# EAGLE board SolarZ (EAGLE 9.3.1), part 1 of 2
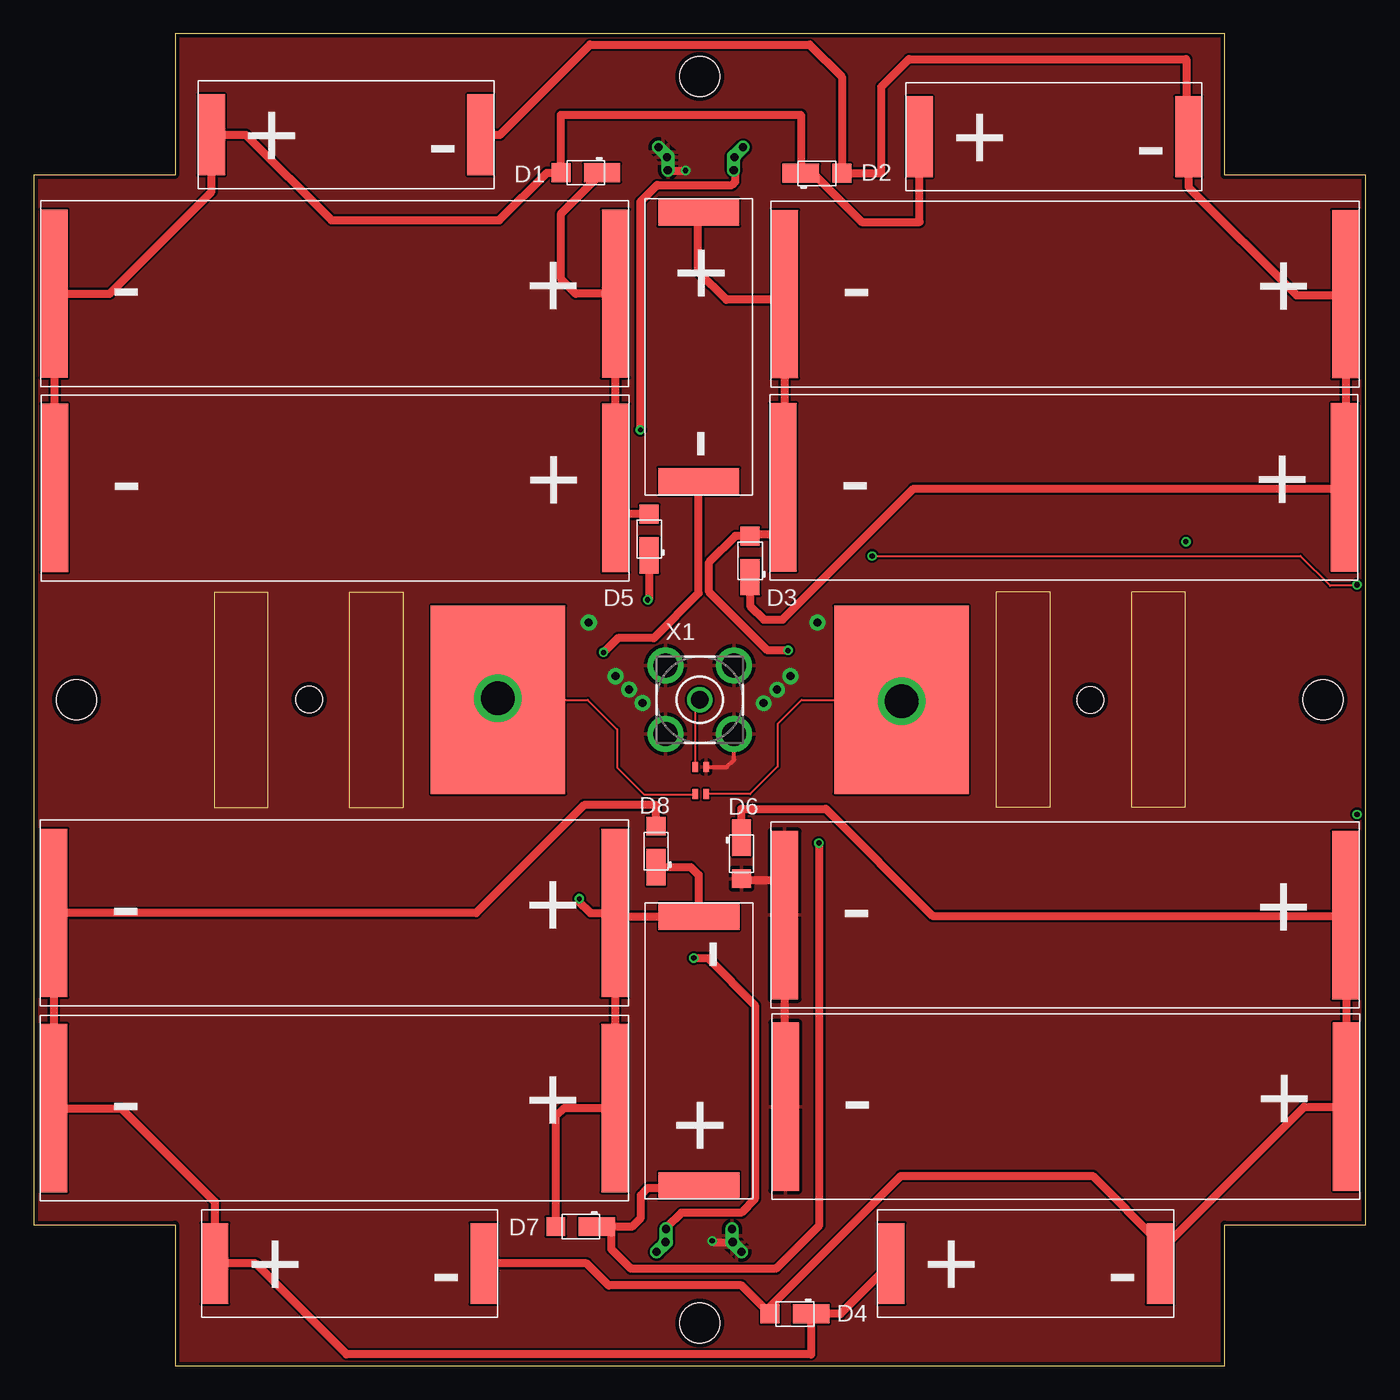
[diagram p1: board, top side]
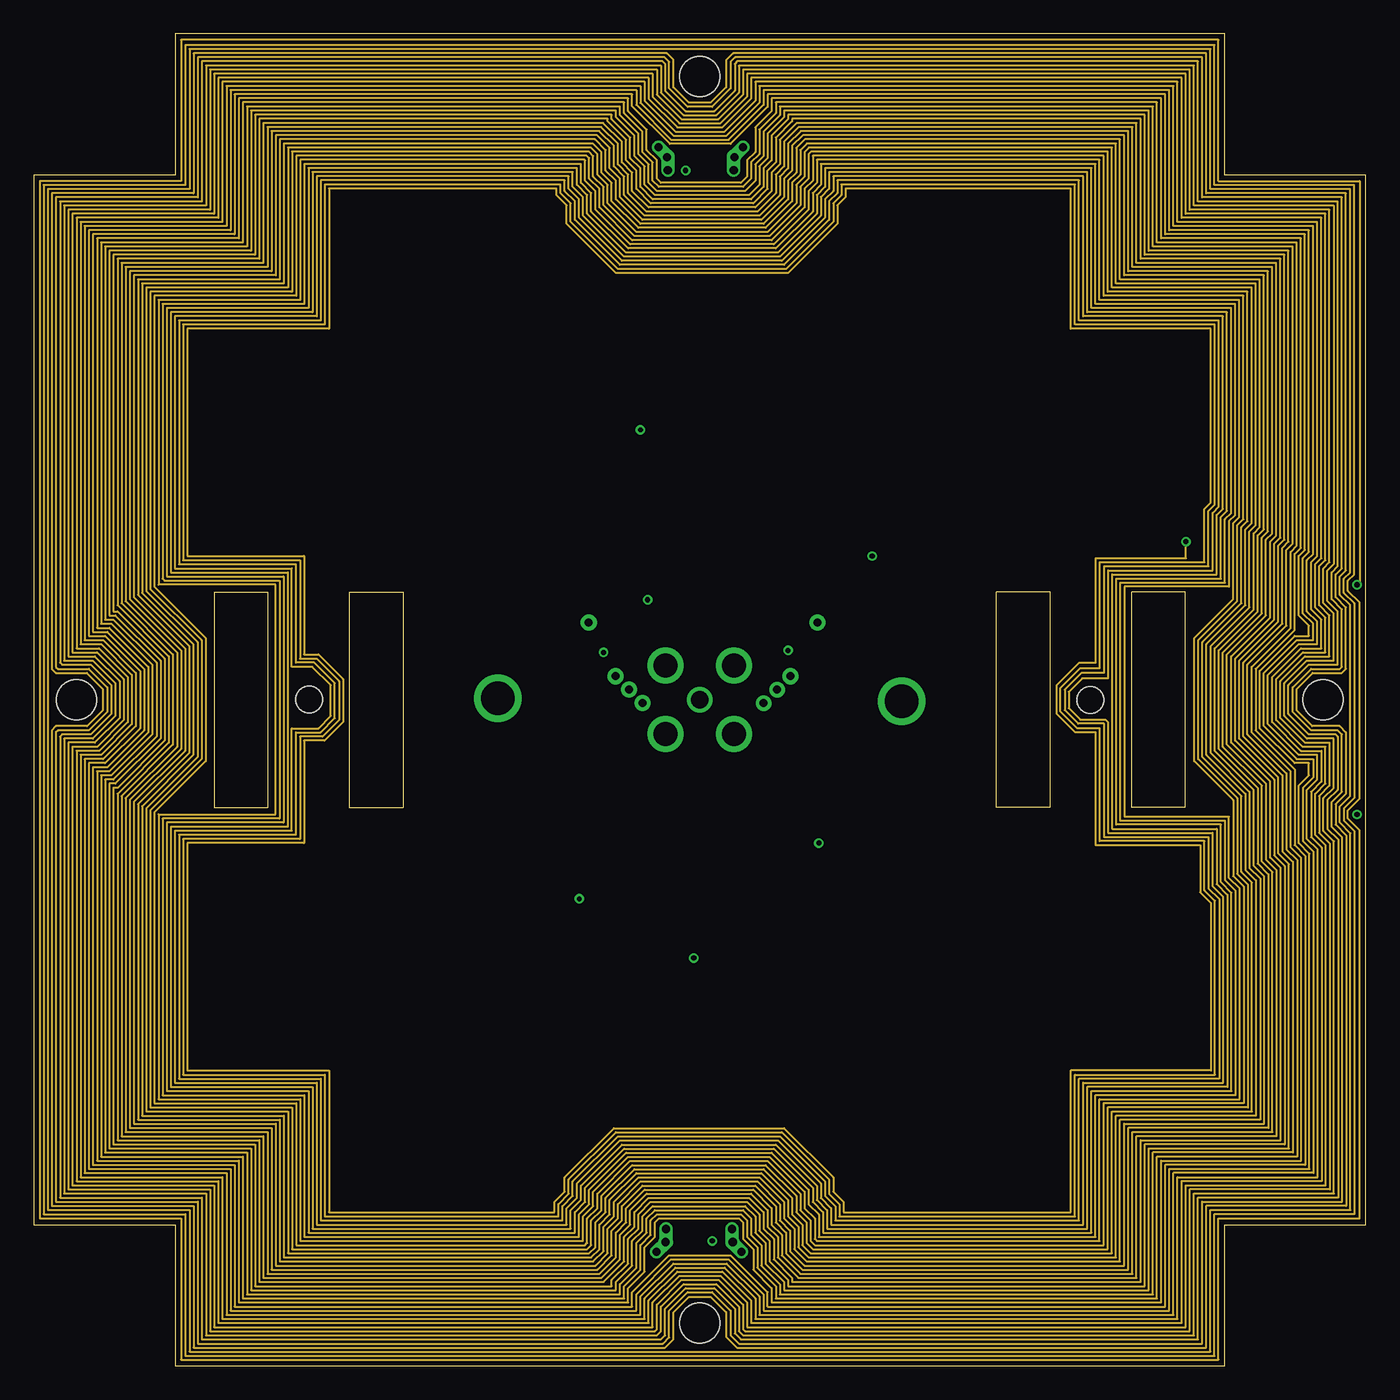
[diagram p2: board, inner layer Route2]
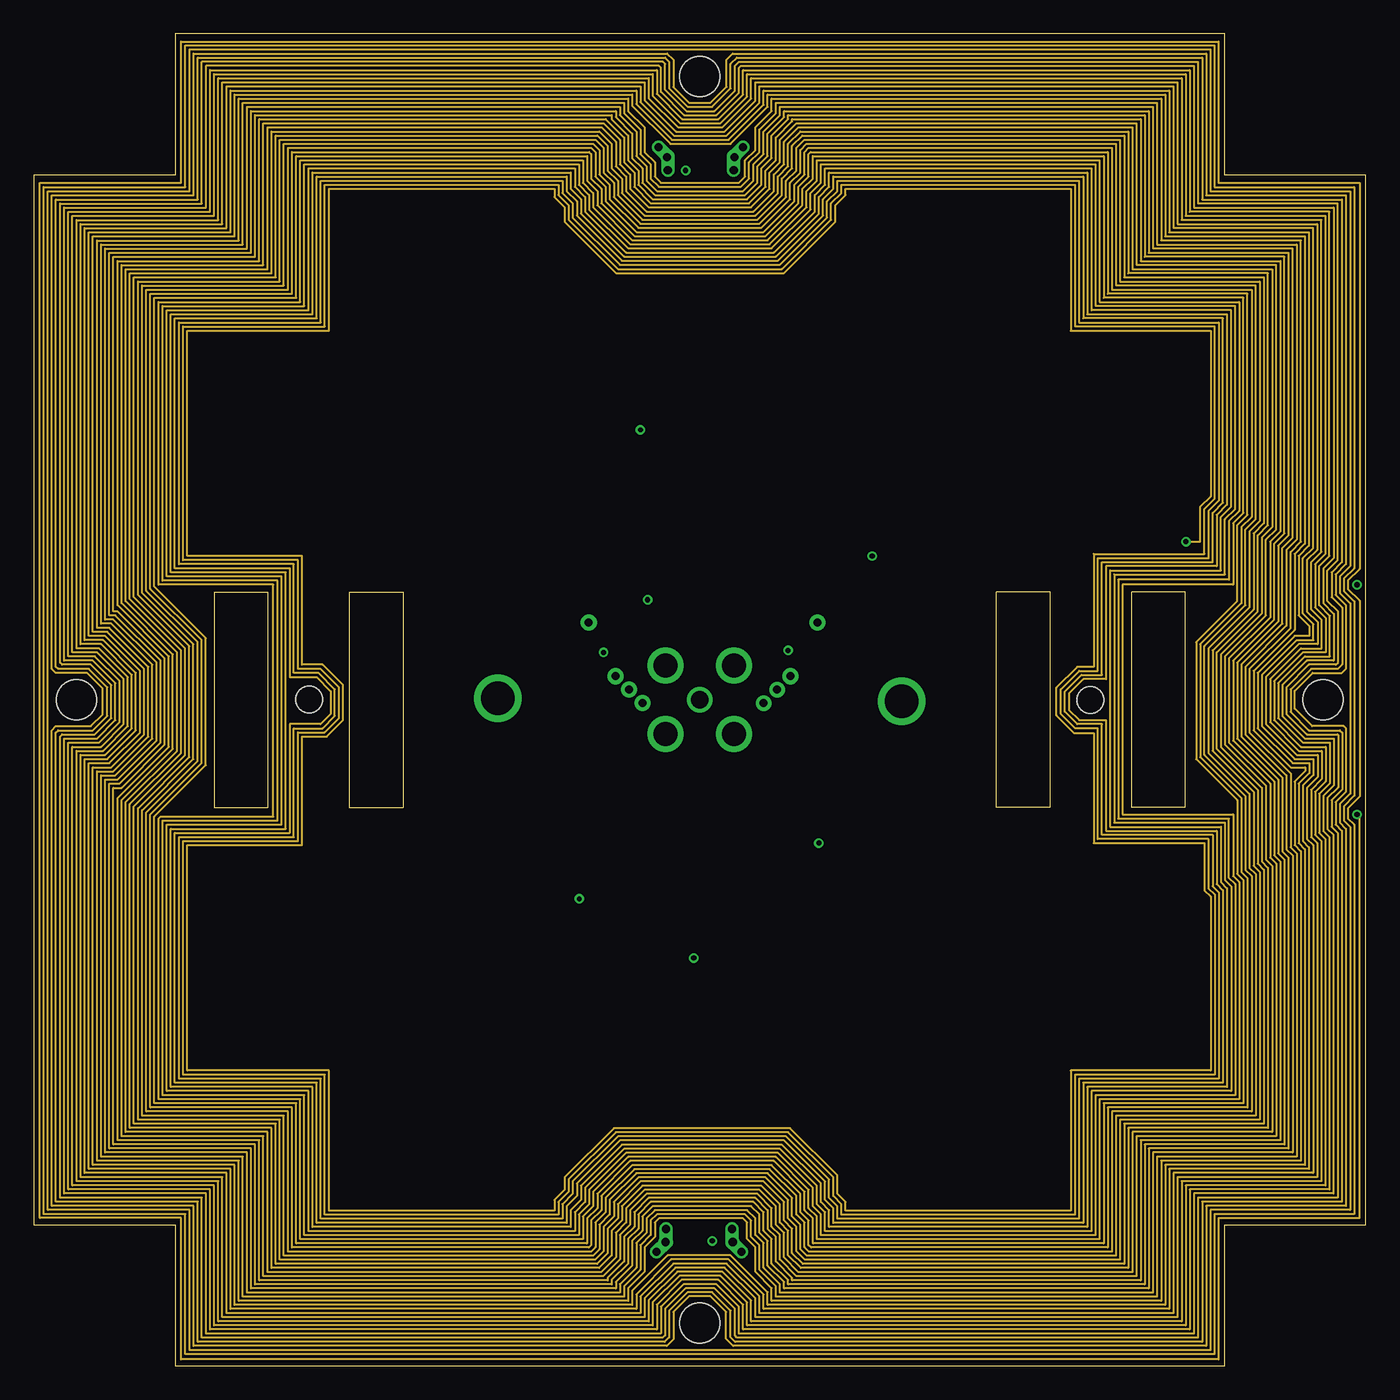
[diagram p3: board, inner layer Route15]
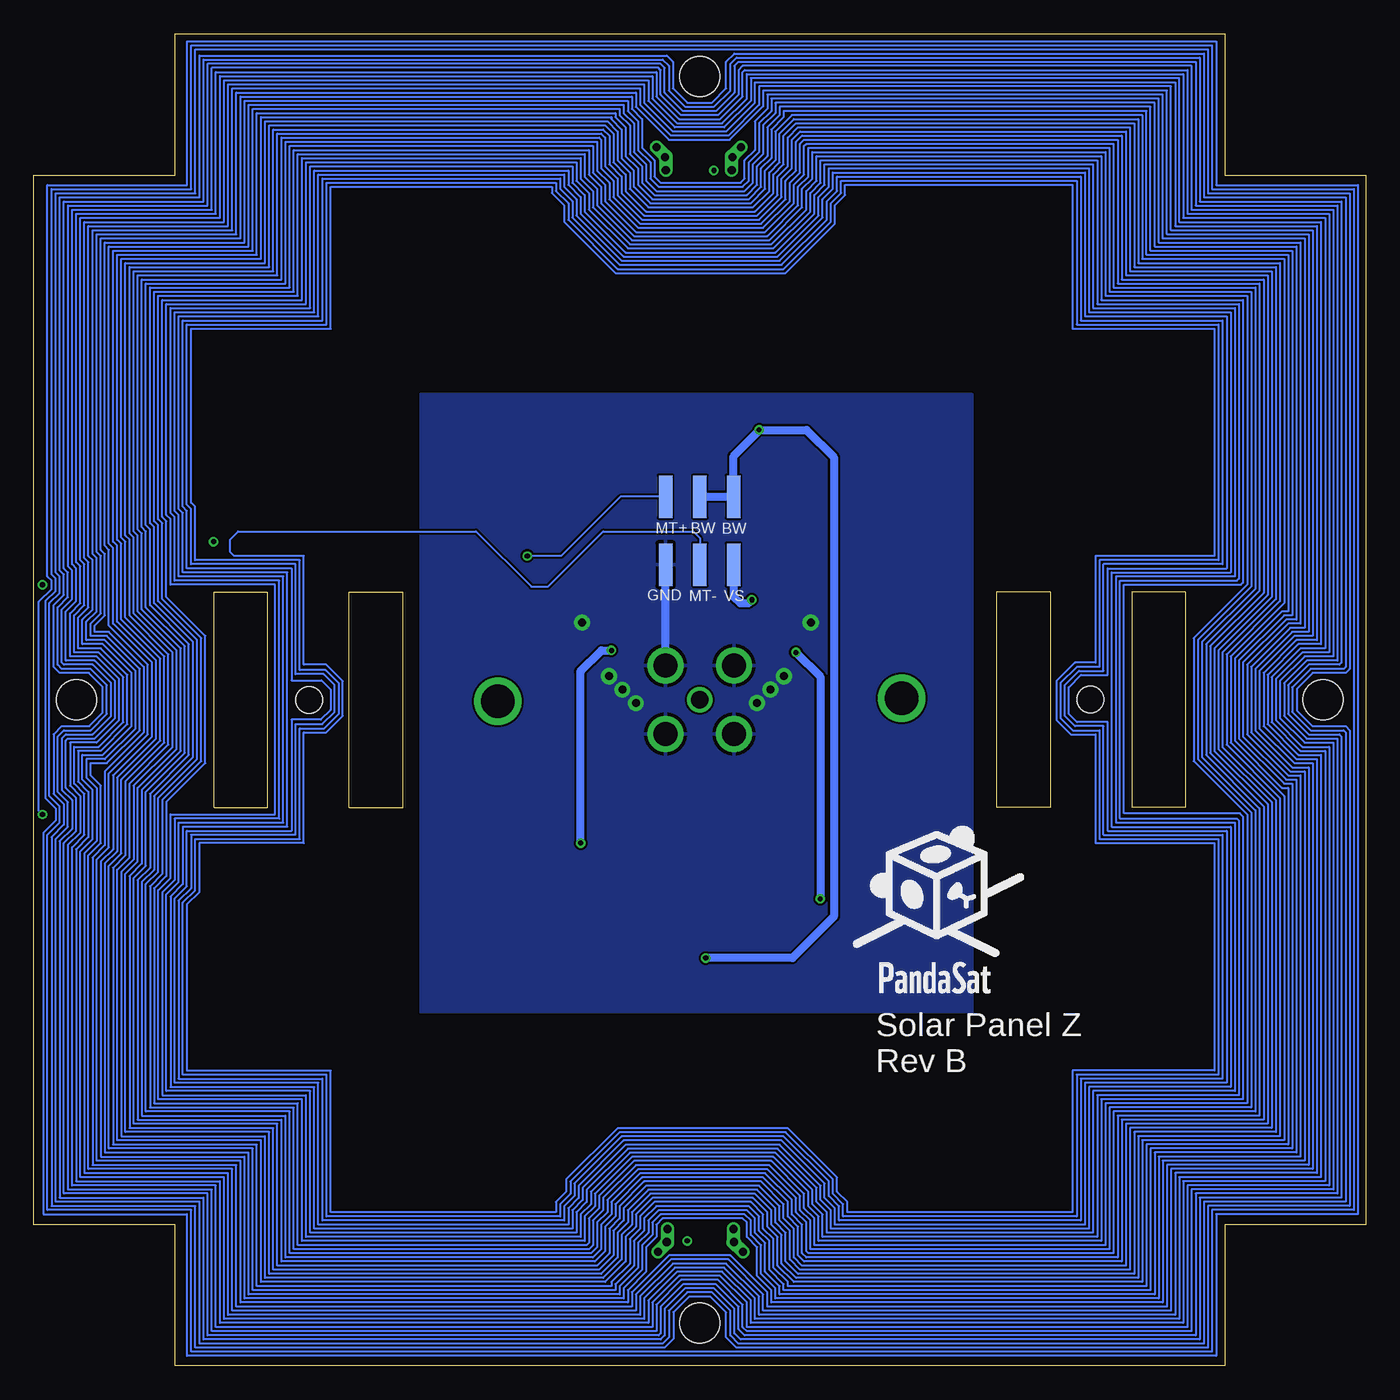
[diagram p4: board, bottom side, seen from below]

Size 99 x 99 mm. Coordinates in mm from the lower left corner, seen from the top.
Outline: 0,10.5 10.5,10.5 10.5,0 88.5,0 88.5,10.5 99,10.5 99,88.5 88.5,88.5 88.5,99 10.5,99 10.5,88.5 0,88.5 0,10.5
Copper layers (1*2*15*16): Top 0.035559375mm / dielectric 0.17018125mm / Route2 0.01778125mm / dielectric 47mil / Route15 0.01778125mm / dielectric 0.17018125mm / Bottom 0.035559375mm
Design rules "oshpark-4layer *": minimum track width 6mil, minimum drill 10mil, track to track 6mil, track to pad 6mil, pad to pad 6mil, via to via 10mil, smd to smd 6mil, copper to edge 12mil, drill to drill 6mil, minimum pad ring 4mil, minimum via ring 4mil, stop-mask expansion 2.5mil, vias tented up to drill 0mil, thermal gap 10mil
Net classes: 0 default: width 0.152 mm, drill 0.3 mm, clearance 0.127 mm
Holes 3 mm at 49.5,3.17 3.17,49.5 49.5,95.83 95.83,49.5
tKeepout: area 46.8,0.4 to 52.2,5.9; area 0.4,46.8 to 5.9,52.2; area 46.8,93.1 to 52.2,98.6; area 93.1,46.8 to 98.6,52.2
bKeepout: area 46.8,0.4 to 52.2,5.9; area 0.6,46.8 to 6.1,52.2; area 46.8,93.1 to 52.2,98.6; area 93.1,46.8 to 98.6,52.2

## Footprints (pad centres in the part's own frame; a part is rotated, then mirrored left to right if it is on the bottom)
KXOB22-04X3F = smd 2 x 6: P$1 1,4; P$2 21,4
SLMD121H04L = smd 2 x 12.5: P$1 1,6.9; P$2 42.7,6.9
SB_DIODE = smd 2.7 x 1.4: NEG -1.2,0 | smd 1.4 x 1.4: POS 1.85,0
BURN_WIRE = drill 0.6 pad 1.016 offset: 1 -5.65,-2.032; 2 0.65,-2.032; 100 -4.95,-0.332; 200 -0.05,-0.332 | drill 0.6 pad 1.016: 10 -5,-1.3; 20 0,-1.3
BALUN = smd 0.4 x 0.75: 1 -0.4,1; 2 0.4,1; 3 -0.4,-1; 4 0.4,-1
TAPE = drill 2.5 pad 3: RF 0,0.1 | smd 10 x 14: RF_2 0,0 | hole 2: -14.03,0.02
M20-8760342 = smd 1 x 3.15: P$1 0.5,1.575; P$2 0.5,6.625; P$3 3.04,1.575; P$4 3.04,6.625; P$5 5.54,1.575; P$6 5.54,6.625
BU-SMA-V = drill 1.27: 1 0,0 | drill 1.778: 2 -2.55,2.55; 3 2.55,2.55; 4 2.55,-2.55; 5 -2.55,-2.55

## Placement (x,y rotation side)
1  KXOB22-04X3F  [KXOB22-04X3F]  34.22,95.49 180 top
2  SLMD121H04L  [SLMD121H04L]  0.56,58.34 0 top
3  SLMD121H04L  [SLMD121H04L]  0.52,72.78 0 top
4  SLMD121H04L  [SLMD121H04L]  54.8,72.74 0 top
5  SLMD121H04L  [SLMD121H04L]  54.7,58.38 0 top
6  KXOB22-04X3F  [KXOB22-04X3F]  84.72,11.61 180 top
7  KXOB22-04X3F  [KXOB22-04X3F]  34.47,11.61 180 top
8  SLMD121H04L  [SLMD121H04L]  54.8,26.6 0 top
9  SLMD121H04L  [SLMD121H04L]  54.86,12.36 0 top
10  KXOB22-04X3F  [KXOB22-04X3F]  45.45,34.4 270 top
11  KXOB22-04X3F  [KXOB22-04X3F]  53.42,64.72 90 top
12  SLMD121H04L  [SLMD121H04L]  0.5,26.75 0 top
13  KXOB22-04X3F  [KXOB22-04X3F]  86.83,95.33 180 top
14  SLMD121H04L  [SLMD121H04L]  0.5,12.25 0 top
D1  SB_DIODE  [SB_DIODE]  41.04,88.67 180 top
D2  SB_DIODE  [SB_DIODE]  58.22,88.62 0 top
D3  SB_DIODE  [SB_DIODE]  53.24,59.82 90 top
D4  SB_DIODE  [SB_DIODE]  56.57,3.86 180 top
D5  SB_DIODE  [SB_DIODE]  45.74,61.44 90 top
D6  SB_DIODE  [SB_DIODE]  52.6,38.05 270 top
D7  SB_DIODE  [SB_DIODE]  40.65,10.35 180 top
D8  SB_DIODE  [SB_DIODE]  46.25,38.25 90 top
F1  [BURN_WIRE]  51.95,10.5 0 top
F2  [BURN_WIRE]  47.07,88.53 180 top
U$1  BALUN  [BALUN]  49.58,43.49 180 top
U$2  [TAPE]  64.5,49.5 180 top
U$3  [TAPE]  34.5,49.5 0 top
U$4  M20-8760342  [M20-8760342]  52.53,57.97 0 bottom
X1  BU-SMA-V  [BU-SMA-V]  49.5,49.5 0 top

## Tracks (layer width: path | path; a pad name or v marks a point on that pad's centre or on a via)
GND  (via drill 0.38 pad 0.7, 0.6 pad 1.15, 0.6 pad 1.2)
  Top 0.305: U$1.3 51.5,44.49 52.05,45.04 X1.4
  Top 0.61: D6.POS 52.7,36.1 55.71,36.1 55.8,36.01 8.P$1 55.8,19.32 9.P$1 | v50.43,9.28 50.51,9.2 F1.20 | F1.200 51.95,10.12 F1.20 | F1.2 51.95,9.12 F1.20 | F2.20 47.07,89.91 F2.2 47.12,89.86 F2.200 47.15,88.83 v48.45,88.83
  Bottom 0.61: X1.3 52.05,59.52 U$4.P$1
  other vias: 58.25,55.25 56.25,51.25 55.25,50.25 54.25,49.25 45.25,49.25 44.25,50.25 43.25,51.25 41.25,55.25
  pour Top: 8.36,99.2 8.36,90.66 -0.17,90.66 -0.17,8.36 8.36,8.36 8.36,-0.17 90.66,-0.17 90.66,8.36 99.2,8.36 99.2,90.66 90.66,90.66 90.66,99.2
  pour Bottom: 29.25,72.25 29.25,26.25 70.25,26.25 70.25,72.25
N8
  Top 0.61: D8.POS 46.25,41.66 40.9,41.66 32.89,33.65 12.P$1 14.P$1 6.52,19.15 13.47,12.2 7.P$2 16.49,7.61 23.25,0.85 57.77,0.85 D4.NEG 59.97,3.86 6.P$2
N$1
  Top 0.152: U$1.2 49.16,42.48 45.35,42.48 43.37,44.46 43.37,47.3 41.17,49.5 U$3.RF_2 U$3.RF
N$2
  Top 0.152: U$1.4 49.18,49.18 X1.1
N$3
  Top 0.152: U$1.1 53.24,42.49 55.28,44.53 55.28,47.71 57.07,49.5 U$2.RF_2 U$2.RF
N$6
  Top 0.61: 2.P$1 1.56,79.64 3.P$1 5.64,79.68 13.21,87.26 1.P$2 15.77,91.49 22.13,85.12 34.6,85.12 38.14,88.67 D1.POS 39.19,92.97 57.02,92.97 D2.NEG 57.93,88.62 61.55,85 65.83,85 13.P$2
N$7
  Top 0.61: D5.POS 43.41,63.29 43.26,63.44 2.P$2 43.26,79.64 3.P$2 40.28,79.68 39.2,80.75 39.2,85.62 D1.NEG
N$8  (via drill 0.38 pad 0.7)
  Top 0.152: v62.31,60.18 94.14,60.18 96.35,57.97 98.27,57.97 v98.34,58.05
  Route2 0.152: v85.63,61.25 85.63,60.03 78.93,60.03 78.93,52.26 77.71,52.26 76.03,50.58 76.03,48.45 77.4,47.07 78.93,47.07 78.93,38.69 86.7,38.69 86.7,35.19 87.49,34.4 87.49,21.95 77.08,21.95 77.08,11.41 60.18,11.41 60.18,12.18 59.42,12.94 59.42,14 55.76,17.66 43.11,17.66 39.45,14 39.45,12.94 38.69,12.18 38.69,11.41 21.95,11.41 21.95,21.95 11.41,21.95 11.41,38.84 20.1,38.84 20.1,46.47 21.62,46.47 23,47.84 23,51.04 21.17,52.87 20.1,52.87 20.1,60.18 11.41,60.18 11.41,77.08 21.95,77.08 21.95,87.49 38.84,87.49 38.84,87 39.61,86.24 39.61,84.87 43.26,81.21 56.07,81.21 59.72,84.87 59.72,86.24 60.33,86.85 60.33,87.49 77.08,87.49 77.08,77.08 87.46,77.08 87.46,64.14 87,63.69 87,59.72 79.23,59.72 79.23,51.85 77.77,51.85 76.31,50.39 76.31,48.62 77.55,47.38 79.23,47.38 79.23,39 87,39 87,35.34 87.79,34.55 87.79,21.64 77.38,21.64 77.38,11.11 59.88,11.11 59.88,12.02 59.11,12.78 59.11,13.85 55.61,17.36 43.26,17.36 39.76,13.85 39.76,12.78 39,12.02 39,11.11 21.64,11.11 21.64,21.64 11.11,21.64 11.11,39.15 19.8,39.15 19.8,46.77 21.47,46.77 22.69,47.99 22.69,50.88 21.01,52.56 19.8,52.56 19.8,59.88 11.11,59.88 11.11,77.38 21.64,77.38 21.64,87.79 39.15,87.79 39.15,87.16 39.91,86.39 39.91,85.02 43.42,81.52 55.91,81.52 59.42,85.02 59.42,86.39 60.03,87 60.03,87.79 77.38,87.79 77.38,77.38 87.77,77.38 87.77,63.99 87.31,63.53 87.31,59.42 79.54,59.42 79.54,51.49 77.86,51.49 76.62,50.25 76.62,48.72 77.62,47.72 79.54,47.72 79.54,39.3 87.31,39.3 87.31,35.49 88.09,34.7 88.09,21.34 77.69,21.34 77.69,10.8 59.57,10.8 59.57,11.87 58.81,12.63 58.81,13.7 55.46,17.05 43.42,17.05 40.06,13.7 40.06,12.63 39.3,11.87 39.3,10.8 21.34,10.8 21.34,21.34 10.8,21.34 10.8,39.45 19.49,39.45 19.49,47.07 21.32,47.07 22.39,48.14 22.39,50.73 20.86,52.26 19.49,52.26 19.49,59.57 10.8,59.57 10.8,77.69 21.34,77.69 21.34,88.09 39.45,88.09 39.45,87.31 40.22,86.55 40.22,85.17 43.57,81.82 55.76,81.82 59.11,85.17 59.11,86.55 59.72,87.16 59.72,88.09 77.69,88.09 77.69,77.69 88.07,77.69 88.07,63.84 87.61,63.38 87.61,59.11 79.84,59.11 79.84,51.09 77.93,51.09 76.92,50.08 76.92,48.88 77.77,48.02 79.65,48.02 79.84,47.84 79.84,39.61 87.61,39.61 87.61,35.64 88.4,34.86 88.4,21.03 77.99,21.03 77.99,10.5 59.27,10.5 59.27,11.72 58.5,12.48 58.5,13.55 55.3,16.75 43.57,16.75 40.37,13.55 40.37,12.48 39.61,11.72 39.61,10.5 21.03,10.5 21.03,21.03 10.5,21.03 10.5,39.76 19.19,39.76 19.19,47.38 21.17,47.38 22.08,48.29 22.08,50.58 20.71,51.95 19.19,51.95 19.19,59.27 10.5,59.27 10.5,77.99 21.03,77.99 21.03,88.4 39.76,88.4 39.76,87.46 40.52,86.7 40.52,85.33 43.72,82.13 55.61,82.13 58.81,85.33 58.81,86.7 59.42,87.31 59.42,88.4 77.99,88.4 77.99,77.99 88.38,77.99 88.38,63.69 87.92,63.23 87.92,58.81 80.14,58.81 80.14,39.91 87.92,39.91 87.92,35.8 88.7,35.01 88.7,20.73 78.3,20.73 78.3,10.19 58.96,10.19 58.96,11.57 58.2,12.33 58.2,13.39 55.15,16.44 43.72,16.44 40.67,13.39 40.67,12.33 39.91,11.57 39.91,10.19 20.73,10.19 20.73,20.73 10.19,20.73 10.19,40.06 18.88,40.06 18.88,58.96 10.19,58.96 10.19,78.3 20.73,78.3 20.73,88.7 40.06,88.7 40.06,87.61 40.83,86.85 40.83,85.48 43.87,82.43 55.46,82.43 58.5,85.48 58.5,86.85 59.11,87.46 59.11,88.7 78.3,88.7 78.3,78.3 88.68,78.3 88.68,63.53 88.22,63.08 88.22,58.5 80.45,58.5 80.45,40.22 88.22,40.22 88.22,35.95 89.01,35.16 89.01,20.42 78.6,20.42 78.6,9.89 58.66,9.89 58.66,11.41 57.9,12.18 57.9,13.24 55,16.14 43.87,16.14 40.98,13.24 40.98,12.18 40.22,11.41 40.22,9.89 20.42,9.89 20.42,20.42 9.89,20.42 9.89,40.37 18.58,40.37 18.58,58.66 9.89,58.66 9.89,78.6 20.42,78.6 20.42,89.01 40.37,89.01 40.37,87.77 41.13,87 41.13,85.63 44.03,82.74 55.3,82.74 58.2,85.63 58.2,87 58.81,87.61 58.81,89.01 78.6,89.01 78.6,78.6 88.98,78.6 88.98,63.38 88.53,62.92 88.53,58.2 80.75,58.2 80.75,40.52 88.53,40.52 88.53,36.1 89.31,35.31 89.31,20.12 78.91,20.12 78.91,9.58 58.35,9.58 58.35,11.26 57.59,12.02 57.59,13.09 54.85,15.83 44.03,15.83 41.28,13.09 41.28,12.02 40.52,11.26 40.52,9.58 20.12,9.58 20.12,20.12 9.58,20.12 9.58,40.67 18.27,40.67 18.27,58.35 9.74,58.35 9.58,58.5 9.58,78.91 20.12,78.91 20.12,89.31 40.67,89.31 40.67,87.92 41.44,87.16 41.44,85.78 44.18,83.04 55.15,83.04 57.9,85.78 57.9,87.16 58.5,87.77 58.5,89.31 78.91,89.31 78.91,78.91 89.29,78.91 89.29,63.23 88.83,62.77 88.83,57.9 81.06,57.9 81.06,40.83 88.83,40.83 88.83,36.25 89.62,35.47 89.62,19.81 79.21,19.81 79.21,9.28 58.2,9.28 58.05,9.43 58.05,10.96 57.28,11.72 57.28,12.94 54.69,15.53 44.18,15.53 41.59,12.94 41.59,11.87 40.83,11.11 40.83,9.28 19.81,9.28 19.81,19.81 9.28,19.81 9.28,40.98 17.97,40.98 17.97,58.05 9.28,58.05 9.28,79.21 19.81,79.21 19.81,89.62 40.95,89.62 40.98,89.59 40.98,88.07 41.74,87.31 41.74,85.94 44.33,83.35 55,83.35 57.59,85.94 57.59,87.31 58.2,87.92 58.2,89.62 79.21,89.62 79.21,79.21 89.59,79.21 89.59,63.08 89.14,62.62 89.14,56.98 86.24,54.09 86.24,44.94 89.14,42.05 89.14,36.41 89.92,35.62 89.92,19.51 79.52,19.51 79.52,8.97 58.05,8.97 57.74,9.28 57.74,10.8 56.98,11.57 56.98,12.78 54.54,15.22 44.33,15.22 41.89,12.78 41.89,11.72 41.13,10.96 41.13,9.13 40.98,8.97 19.51,8.97 19.51,19.51 8.97,19.51 8.97,41.13 12.78,44.94 12.78,54.09 8.97,57.9 8.97,79.52 19.51,79.52 19.51,89.92 41.1,89.92 41.28,89.75 41.28,88.22 42.05,87.46 42.05,86.09 44.48,83.65 54.85,83.65 57.28,86.09 57.28,87.46 57.9,88.07 57.9,89.9 57.92,89.92 79.52,89.92 79.52,79.52 89.9,79.52 89.9,62.92 89.44,62.47 89.44,56.83 86.55,53.93 86.55,45.09 89.44,42.2 89.44,36.56 90.23,35.77 90.23,19.2 79.82,19.2 79.82,8.67 57.9,8.67 57.44,9.13 57.44,10.65 56.68,11.41 56.68,12.63 54.39,14.92 44.48,14.92 42.2,12.63 42.2,11.57 41.44,10.8 41.44,8.97 41.13,8.67 19.2,8.67 19.2,19.2 8.67,19.2 8.67,41.28 12.48,45.09 12.48,53.93 8.67,57.74 8.67,79.82 19.2,79.82 19.2,90.23 41.26,90.23 41.59,89.9 41.59,88.38 42.35,87.61 42.35,86.24 44.64,83.95 54.69,83.95 56.98,86.24 56.98,87.61 57.59,88.22 57.59,90.05 57.77,90.23 79.82,90.23 79.82,79.82 90.2,79.82 90.2,62.77 89.75,62.31 89.75,56.68 86.85,53.78 86.85,45.25 89.75,42.35 89.75,36.71 90.53,35.92 90.53,18.9 80.13,18.9 80.13,8.37 57.74,8.37 57.13,8.97 57.13,10.5 56.37,11.26 56.37,12.48 54.24,14.61 44.64,14.61 42.5,12.48 42.5,11.41 41.74,10.65 41.74,8.82 41.28,8.37 18.9,8.37 18.9,18.9 8.37,18.9 8.37,41.44 12.18,45.25 12.18,53.78 8.37,57.59 8.37,80.13 18.9,80.13 18.9,90.53 41.41,90.53 41.89,90.05 41.89,88.53 42.66,87.77 42.66,86.39 44.79,84.26 54.54,84.26 56.68,86.39 56.68,87.77 57.28,88.38 57.28,90.2 57.62,90.53 80.13,90.53 80.13,80.13 90.51,80.13 90.51,62.62 90.05,62.16 90.05,56.52 87.16,53.63 87.16,45.4 90.05,42.5 90.05,36.86 90.84,36.08 90.84,18.59 80.43,18.59 80.43,8.06 57.59,8.06 56.83,8.82 56.83,10.35 56.07,11.11 56.07,12.33 54.09,14.31 44.79,14.31 42.81,12.33 42.81,11.26 42.05,10.5 42.05,8.67 41.44,8.06 18.59,8.06 18.59,18.59 8.06,18.59 8.06,41.59 11.87,45.4 11.87,53.63 8.06,57.44 8.06,80.43 18.59,80.43 18.59,90.84 41.56,90.84 42.2,90.2 42.2,88.68 42.96,87.92 42.96,86.55 44.94,84.56 54.39,84.56 56.37,86.55 56.37,87.92 56.98,88.53 56.98,90.36 57.46,90.84 80.43,90.84 80.43,80.43 90.81,80.43 90.81,62.47 90.36,62.01 90.36,56.37 87.46,53.48 87.46,45.55 90.36,42.66 90.36,37.02 91.14,36.23 91.14,18.29 80.74,18.29 80.74,7.75 57.44,7.75 56.52,8.67 56.52,10.19 55.76,10.96 55.76,12.18 53.93,14 44.94,14 43.11,12.18 43.11,11.11 42.35,10.35 42.35,8.52 41.59,7.75 18.29,7.75 18.29,18.29 7.75,18.29 7.75,41.74 11.57,45.55 11.57,53.48 7.75,57.28 7.75,80.74 18.29,80.74 18.29,91.14 41.72,91.14 42.5,90.36 42.5,88.83 43.26,88.07 43.26,86.7 45.09,84.87 54.24,84.87 56.07,86.7 56.07,88.07 56.68,88.68 56.68,90.51 57.31,91.14 80.74,91.14 80.74,80.74 91.12,80.74 91.12,62.31 90.66,61.86 90.66,56.22 87.77,53.32 87.77,45.7 90.66,42.81 90.66,37.17 91.45,36.38 91.45,17.98 81.04,17.98 81.04,7.45 57.28,7.45 56.22,8.52 56.22,10.04 55.46,10.8 55.46,12.02 53.78,13.7 45.09,13.7 43.42,12.02 43.42,10.96 42.66,10.19 42.66,8.37 41.74,7.45 17.98,7.45 17.98,17.98 7.45,17.98 7.45,41.89 11.26,45.7 11.26,53.32 7.45,57.13 7.45,81.04 17.98,81.04 17.98,91.45 41.87,91.45 42.81,90.51 42.81,88.98 43.57,88.22 43.57,86.85 45.25,85.17 54.09,85.17 55.76,86.85 55.76,88.22 56.37,88.83 56.37,90.66 57.16,91.45 81.04,91.45 81.04,81.04 91.42,81.04 91.42,62.16 90.97,61.7 90.97,56.07 88.07,53.17 88.07,45.85 90.97,42.96 90.97,37.32 91.75,36.53 91.75,17.68 81.35,17.68 81.35,7.15 57.13,7.15 55.91,8.37 55.91,9.89 55.15,10.65 55.15,11.87 53.63,13.39 45.25,13.39 43.72,11.87 43.72,10.8 42.96,10.04 42.96,8.21 41.89,7.15 17.68,7.15 17.68,17.68 7.15,17.68 7.15,42.05 10.96,45.85 10.96,53.17 7.15,56.98 7.15,81.35 17.68,81.35 17.68,91.75 42.02,91.75 43.11,90.66 43.11,89.14 43.87,88.38 43.87,87 45.4,85.48 53.93,85.48 55.46,87 55.46,88.38 56.07,88.98 56.07,90.81 57.01,91.75 81.35,91.75 81.35,81.35 91.73,81.35 91.73,62.01 91.27,61.55 91.27,55.91 88.38,53.02 88.38,46.01 91.27,43.11 91.27,37.47 92.06,36.69 92.06,17.38 81.65,17.38 81.65,6.84 56.98,6.84 55.61,8.21 55.61,9.74 54.85,10.5 54.85,11.72 53.48,13.09 45.4,13.09 44.03,11.72 44.03,10.65 43.26,9.89 43.26,8.06 42.05,6.84 17.38,6.84 17.38,17.38 6.84,17.38 6.84,42.2 10.65,46.01 10.65,53.02 6.84,56.83 6.84,81.65 17.38,81.65 17.38,92.06 42.17,92.06 43.42,90.81 43.42,89.29 44.18,88.53 44.18,87.16 45.55,85.78 53.78,85.78 55.15,87.16 55.15,88.53 55.76,89.14 55.76,90.97 56.85,92.06 81.65,92.06 81.65,81.65 92.03,81.65 92.03,61.86 91.58,61.4 91.58,55.76 88.68,52.87 88.68,46.16 91.58,43.26 91.58,37.63 92.36,36.84 92.36,17.07 81.95,17.07 81.95,6.54 56.83,6.54 55.3,8.06 55.3,9.58 54.54,10.35 54.54,11.57 53.32,12.78 45.55,12.78 44.33,11.57 44.33,10.5 43.57,9.74 43.57,7.91 42.2,6.54 17.07,6.54 17.07,17.07 6.54,17.07 6.54,42.35 10.35,46.16 10.35,52.87 6.54,56.68 6.54,81.95 17.07,81.95 17.07,92.36 42.33,92.36 43.72,90.97 43.72,89.44 44.48,88.68 44.48,87.31 45.7,86.09 53.63,86.09 54.85,87.31 54.85,88.68 55.46,89.29 55.46,91.12 56.7,92.36 81.95,92.36 81.95,81.95 92.34,81.95 92.34,61.7 91.88,61.25 91.88,55.61 88.98,52.71 88.98,46.31 91.88,43.42 91.88,37.78 92.67,36.99 92.67,16.77 82.26,16.77 82.26,6.23 56.37,6.23 56.37,6.54 55,7.91 55,9.43 54.24,10.19 54.24,11.41 53.17,12.48 45.7,12.48 44.64,11.41 44.64,10.35 43.87,9.58 43.87,7.75 42.35,6.23 16.77,6.23 16.77,16.77 6.23,16.77 6.23,42.5 10.04,46.31 10.04,52.71 6.23,56.52 6.23,82.26 16.77,82.26 16.77,92.67 42.66,92.67 42.66,92.49 44.03,91.12 44.03,89.59 44.79,88.83 44.79,87.46 45.85,86.39 53.48,86.39 54.54,87.46 54.54,88.83 55.15,89.44 55.15,91.27 56.37,92.49 56.37,92.67 82.26,92.67 82.26,82.26 92.64,82.26 92.64,61.55 92.19,61.09 92.19,55.46 89.29,52.56 89.29,46.47 92.19,43.57 92.19,37.93 92.97,37.14 92.97,16.46 82.56,16.46 82.56,5.93 56.07,5.93 56.07,6.38 54.69,7.75 54.69,9.28 53.93,10.04 53.93,11.26 53.02,12.18 45.85,12.18 44.94,11.26 44.94,10.19 44.18,9.43 44.18,7.6 42.96,6.38 42.96,5.93 16.46,5.93 16.46,16.46 5.93,16.46 5.93,42.96 6.23,42.96 9.74,46.47 9.74,52.56 6.23,56.07 5.93,56.07 5.93,82.56 16.46,82.56 16.46,92.97 42.96,92.97 42.96,92.64 44.33,91.27 44.33,89.75 45.09,88.98 45.09,87.61 46.01,86.7 53.32,86.7 54.24,87.61 54.24,88.98 54.85,89.59 54.85,91.42 56.07,92.64 56.07,92.97 82.56,92.97 82.56,82.56 92.95,82.56 92.95,61.4 92.49,60.94 92.49,55.3 89.59,52.41 89.59,46.62 92.49,43.72 92.49,38.08 93.28,37.3 93.28,16.16 82.87,16.16 82.87,5.62 55.76,5.62 55.76,6.23 54.39,7.6 54.39,9.13 53.63,9.89 53.63,11.11 52.87,11.87 46.01,11.87 45.25,11.11 45.25,10.04 44.48,9.28 44.48,7.45 43.26,6.23 43.26,5.62 16.16,5.62 16.16,16.16 5.62,16.16 5.62,43.26 6.08,43.26 9.43,46.62 9.43,52.41 6.08,55.76 5.62,55.76 5.62,82.87 16.16,82.87 16.16,93.28 43.26,93.28 43.26,92.79 44.64,91.42 44.64,89.9 45.4,89.14 45.4,87.77 46.16,87 53.17,87 53.93,87.77 53.93,89.14 54.54,89.75 54.54,91.58 55.76,92.79 55.76,93.28 82.87,93.28 82.87,82.87 93.25,82.87 93.25,61.25 92.79,60.79 92.79,55.15 89.9,52.26 89.9,46.77 92.79,43.87 92.79,38.23 93.58,37.45 93.58,15.85 83.17,15.85 83.17,5.32 55.46,5.32 55.46,6.08 54.09,7.45 54.09,8.97 53.32,9.74 53.32,10.96 52.71,11.57 46.16,11.57 45.55,10.96 45.55,9.89 44.79,9.13 44.79,7.3 43.57,6.08 43.57,5.32 15.85,5.32 15.85,15.85 5.32,15.85 5.32,43.57 5.93,43.57 9.13,46.77 9.13,52.26 5.93,55.46 5.32,55.46 5.32,83.17 15.85,83.17 15.85,93.58 43.57,93.58 43.57,92.95 44.94,91.58 44.94,90.05 45.7,89.29 45.7,87.92 46.31,87.31 52.87,87.31 53.63,88.07 53.63,89.29 54.24,89.9 54.24,91.73 55.46,92.95 55.46,93.58 83.17,93.58 83.17,83.17 93.56,83.17 93.56,61.09 93.1,60.64 93.1,55 90.2,52.1 90.2,46.92 93.1,44.03 93.1,38.39 93.89,37.6 93.89,15.55 83.48,15.55 83.48,5.01 55.15,5.01 55.15,5.93 53.78,7.3 53.78,8.82 53.02,9.58 53.02,10.8 52.56,11.26 46.31,11.26 45.85,10.8 45.85,9.74 45.09,8.97 45.09,7.15 43.87,5.93 43.87,5.01 15.55,5.01 15.55,15.55 5.01,15.55 5.01,43.87 5.77,43.87 8.82,46.92 8.82,52.1 5.77,55.15 5.01,55.15 5.01,83.48 15.55,83.48 15.55,93.89 43.87,93.89 43.87,93.1 45.25,91.73 45.25,90.2 46.01,89.44 46.01,88.07 46.47,87.61 52.71,87.61 53.32,88.22 53.32,89.44 53.93,90.05 53.93,91.88 55.15,93.1 55.15,93.89 83.48,93.89 83.48,83.48 93.86,83.48 93.86,60.94 93.4,60.49 93.4,54.85 90.51,51.95 90.51,47.07 93.4,44.18 93.4,38.54 94.19,37.75 94.19,15.24 83.78,15.24 83.78,4.71 54.85,4.71 54.85,5.77 53.48,7.15 53.48,8.67 52.71,9.43 52.71,10.65 52.41,10.96 46.47,10.96 46.16,10.65 46.16,9.58 45.4,8.82 45.4,6.99 44.18,5.77 44.18,4.71 15.24,4.71 15.24,15.24 4.71,15.24 4.71,44.18 5.62,44.18 8.52,47.07 8.52,51.95 5.62,54.85 4.71,54.85 4.71,83.78 15.24,83.78 15.24,94.19 44.18,94.19 44.18,93.25 45.55,91.88 45.55,90.36 46.31,89.59 46.31,88.22 46.62,87.92 52.56,87.92 53.02,88.38 53.02,89.59 53.63,90.2 53.63,92.03 54.85,93.25 54.85,94.19 83.78,94.19 83.78,83.78 94.17,83.78 94.17,60.79 93.71,60.33 93.71,54.69 90.81,51.8 90.81,47.23 93.71,44.33 93.71,38.69 94.5,37.91 94.5,14.94 84.09,14.94 84.09,4.4 54.54,4.4 54.54,5.47 51.8,8.21 47.23,8.21 44.48,5.47 44.48,4.4 14.94,4.4 14.94,14.94 4.4,14.94 4.4,44.48 5.47,44.48 8.21,47.23 8.21,51.8 5.47,54.54 4.4,54.54 4.4,84.09 14.94,84.09 14.94,94.5 44.48,94.5 44.48,93.6 47.27,90.81 51.8,90.81 54.54,93.56 54.54,94.5 84.09,94.5 84.09,84.09 94.47,84.09 94.47,60.64 94.01,60.18 94.01,55.76 94.78,55 94.78,54.24 93.71,54.24 91.12,51.65 91.12,47.38 93.71,44.79 94.78,44.79 94.78,43.87 94.01,43.11 94.01,38.84 94.8,38.06 94.8,14.63 84.39,14.63 84.39,4.1 54.24,4.1 54.24,5.32 51.65,7.91 47.38,7.91 44.79,5.32 44.79,4.1 14.63,4.1 14.63,14.63 4.1,14.63 4.1,44.79 5.32,44.79 7.91,47.38 7.91,51.65 5.32,54.24 4.1,54.24 4.1,84.39 14.63,84.39 14.63,94.8 44.79,94.8 44.79,93.71 47.38,91.12 51.65,91.12 54.24,93.71 54.24,94.8 84.39,94.8 84.39,84.39 94.78,84.39 94.78,60.49 94.32,60.03 94.32,55.91 95.08,55.15 95.08,53.93 93.86,53.93 91.42,51.49 91.42,47.53 93.86,45.09 95.08,45.09 95.08,43.72 94.32,42.96 94.32,39 95.11,38.21 95.11,14.33 84.7,14.33 84.7,3.79 53.93,3.79 53.93,5.16 51.49,7.6 47.53,7.6 45.09,5.16 45.09,3.79 14.33,3.79 14.33,14.33 3.79,14.33 3.79,45.09 5.16,45.09 7.6,47.53 7.6,51.49 5.16,53.93 3.79,53.93 3.79,84.7 14.33,84.7 14.33,95.11 45.09,95.11 45.09,93.86 47.53,91.42 51.49,91.42 53.93,93.86 53.93,95.11 84.7,95.11 84.7,84.7 95.08,84.7 95.08,60.33 94.62,59.88 94.62,56.07 95.39,55.3 95.39,53.63 94.01,53.63 91.73,51.34 91.73,47.68 94.01,45.4 95.39,45.4 95.39,43.57 94.62,42.81 94.62,39.15 95.41,38.36 95.41,14.02 85,14.02 85,3.49 53.63,3.49 53.63,5.01 51.34,7.3 47.68,7.3 45.4,5.01 45.4,3.49 14.02,3.49 14.02,14.02 3.49,14.02 3.49,45.4 5.01,45.4 7.3,47.68 7.3,51.34 5.01,53.63 3.49,53.63 3.49,85 14.02,85 14.02,95.41 45.4,95.41 45.4,94.01 47.68,91.73 51.34,91.73 53.63,94.01 53.63,95.41 85,95.41 85,85 95.39,85 95.39,60.18 94.93,59.72 94.93,56.22 95.69,55.46 95.69,53.32 94.17,53.32 92.03,51.19 92.03,47.84 94.17,45.7 95.69,45.7 95.69,43.42 94.93,42.66 94.93,39.3 95.72,38.52 95.72,13.72 85.31,13.72 85.31,3.18 53.32,3.18 53.32,4.86 51.19,6.99 47.84,6.99 45.7,4.86 45.7,3.18 13.72,3.18 13.72,13.72 3.18,13.72 3.18,45.7 4.86,45.7 6.99,47.84 6.99,51.19 4.86,53.32 3.18,53.32 3.18,85.31 13.72,85.31 13.72,95.72 45.7,95.72 45.7,94.17 47.84,92.03 51.19,92.03 53.32,94.17 53.32,95.72 85.31,95.72 85.31,85.31 95.69,85.31 95.69,60.03 95.23,59.57 95.23,56.37 96,55.61 96,53.02 94.32,53.02 92.34,51.04 92.34,47.99 94.32,46.01 96,46.01 96,43.26 95.23,42.5 95.23,39.45 96.02,38.67 96.02,13.41 85.61,13.41 85.61,2.88 53.02,2.88 53.02,4.71 51.04,6.69 47.99,6.69 46.01,4.71 46.01,2.88 13.41,2.88 13.41,13.41 2.88,13.41 2.88,46.01 4.71,46.01 6.69,47.99 6.69,51.04 4.71,53.02 2.88,53.02 2.88,85.61 13.41,85.61 13.41,96.02 46.01,96.02 46.01,94.32 47.99,92.34 51.04,92.34 53.02,94.32 53.02,96.02 85.61,96.02 85.61,85.61 96,85.61 96,59.88 95.54,59.42 95.54,56.52 96.3,55.76 96.3,52.71 94.47,52.71 92.64,50.88 92.64,48.14 94.47,46.31 96.3,46.31 96.3,43.11 95.54,42.35 95.54,39.61 96.33,38.82 96.33,13.11 85.92,13.11 85.92,2.57 52.87,2.57 52.71,2.73 52.71,4.55 50.88,6.38 48.14,6.38 46.31,4.55 46.31,2.73 46.16,2.57 13.11,2.57 13.11,13.11 2.57,13.11 2.57,46.31 4.55,46.31 6.38,48.14 6.38,50.88 4.55,52.71 2.57,52.71 2.57,85.92 13.11,85.92 13.11,96.33 46.31,96.33 46.31,94.47 48.14,92.64 50.88,92.64 52.71,94.47 52.71,96.33 85.92,96.33 85.92,85.92 96.3,85.92 96.3,59.72 95.84,59.27 95.84,56.68 96.6,55.91 96.6,52.41 94.62,52.41 92.95,50.73 92.95,48.29 94.62,46.62 96.6,46.62 96.6,42.96 95.84,42.2 95.84,39.76 96.63,38.97 96.63,12.8 86.22,12.8 86.22,2.27 52.71,2.27 52.41,2.57 52.41,4.4 50.73,6.08 48.29,6.08 46.62,4.4 46.62,2.57 46.31,2.27 12.8,2.27 12.8,12.8 2.27,12.8 2.27,46.62 4.4,46.62 6.08,48.29 6.08,50.73 4.4,52.41 2.27,52.41 2.27,86.22 12.8,86.22 12.8,96.63 46.59,96.63 46.62,96.6 46.62,94.62 48.29,92.95 50.73,92.95 52.41,94.62 52.41,96.6 52.43,96.63 86.22,96.63 86.22,86.22 96.6,86.22 96.6,59.57 96.15,59.11 96.15,56.83 96.91,56.07 96.91,52.1 94.78,52.1 93.25,50.58 93.25,48.45 94.78,46.92 96.76,46.92 96.91,46.77 96.91,42.81 96.15,42.05 96.15,39.91 96.94,39.12 96.94,12.5 86.53,12.5 86.53,1.96 52.56,1.96 52.1,2.42 52.1,4.25 50.58,5.77 48.45,5.77 46.92,4.25 46.92,2.27 46.62,1.96 12.5,1.96 12.5,12.5 1.96,12.5 1.96,46.77 2.12,46.92 4.25,46.92 5.77,48.45 5.77,50.58 4.25,52.1 2.12,52.1 1.96,52.26 1.96,86.53 12.5,86.53 12.5,96.94 46.74,96.94 46.92,96.76 46.92,94.78 48.45,93.25 50.58,93.25 52.1,94.78 52.1,96.76 52.28,96.94 86.53,96.94 86.53,86.53 96.91,86.53 96.91,59.42 96.45,58.96 96.45,56.98 97.21,56.22 97.21,51.95 97.06,51.8 94.93,51.8 93.56,50.43 93.56,48.6 94.93,47.23 96.91,47.23 97.21,46.92 97.21,42.66 96.45,41.89 96.45,40.06 97.24,39.28 97.24,12.19 86.83,12.19 86.83,1.66 52.41,1.66 51.8,2.27 51.8,4.1 50.43,5.47 48.6,5.47 47.23,4.1 47.23,2.12 46.77,1.66 12.19,1.66 12.19,12.19 1.66,12.19 1.66,47.07 1.81,47.23 4.1,47.23 5.47,48.6 5.47,50.43 4.1,51.8 1.81,51.8 1.66,51.95 1.66,86.83 12.19,86.83 12.19,97.24 46.9,97.24 47.23,96.91 47.23,94.93 48.6,93.56 50.43,93.56 51.8,94.93 51.8,96.91 52.13,97.24 86.83,97.24 86.83,86.83 97.21,86.83 97.21,59.27 96.76,58.81 96.76,57.13 97.52,56.37 97.52,51.8 97.21,51.49 95.05,51.49 93.87,50.31 93.87,48.69 95.01,47.54 97.05,47.54 97.52,47.07 97.52,42.5 96.76,41.74 96.76,40.22 97.54,39.43 97.54,11.89 87.14,11.89 87.14,1.35 52.26,1.35 51.46,2.15 51.46,3.99 50.31,5.13 48.69,5.13 47.53,3.97 47.53,1.96 46.92,1.35 11.89,1.35 11.89,11.89 1.35,11.89 1.35,47.23 1.66,47.53 3.97,47.53 5.13,48.69 5.13,50.31 3.95,51.49 1.66,51.49 1.35,51.8 1.35,87.14 11.89,87.14 11.89,97.54 47.05,97.54 47.54,97.05 47.54,95.01 48.69,93.87 50.31,93.87 51.46,95.01 51.46,97.03 51.98,97.54 87.14,97.54 87.14,87.14 97.52,87.14 97.52,59.11 97.06,58.66 97.06,57.28 97.82,56.52 97.82,42.35 97.06,41.59 97.06,40.37 97.85,39.58 97.85,11.58 87.44,11.58 87.44,1.05 11.58,1.05 11.58,11.58 1.05,11.58 1.05,87.44 11.58,87.44 11.58,97.85 87.44,97.85 87.44,87.44 97.82,87.44 97.82,58.96 97.37,58.5 97.37,57.44 98.13,56.68 98.13,42.2 97.37,41.44 97.37,40.52 98.15,39.73 98.15,11.28 87.75,11.28 87.75,0.75 11.28,0.75 11.28,11.28 0.75,11.28 0.75,87.75 11.28,87.75 11.28,98.15 87.75,98.15 87.75,87.75 98.13,87.75 98.13,58.81 97.67,58.35 97.67,57.59 98.54,56.72 98.54,42.15 97.67,41.28 97.67,40.67 98.54,39.8 98.54,10.96 88.04,10.96 88.04,0.46 10.96,0.46 10.96,10.96 0.46,10.96 0.46,88.04 10.96,88.04 10.96,98.54 88.04,98.54 88.04,88.04 98.54,88.04 98.54,58.24 v98.34,58.05
  Route15 0.152: v85.63,61.25 86.7,61.25 86.7,63.84 87.46,64.6 87.46,76.93 77.08,76.93 77.08,87.46 60.33,87.46 60.33,87 59.57,86.24 59.57,85.02 55.76,81.21 43.26,81.21 39.45,85.02 39.45,86.09 38.69,86.85 38.69,87.46 21.95,87.46 21.95,76.93 11.41,76.93 11.41,60.18 19.95,60.18 19.95,52.1 21.47,52.1 23,50.58 23,47.99 21.78,46.77 19.95,46.77 19.95,38.69 11.41,38.69 11.41,21.95 21.95,21.95 21.95,11.54 38.69,11.54 38.69,12.33 39.45,13.09 39.45,14 43.11,17.66 56.22,17.66 59.72,14.16 59.72,12.78 60.33,12.18 60.33,11.54 77.08,11.54 77.08,21.95 87.46,21.95 87.46,34.88 87,35.34 87,38.84 78.77,38.84 78.77,47.02 77.32,47.02 76.01,48.33 76.01,50.4 77.55,51.95 78.77,51.95 78.77,60.33 87,60.33 87,63.69 87.77,64.45 87.77,77.23 77.38,77.23 77.38,87.77 60.03,87.77 60.03,87.16 59.27,86.39 59.27,85.17 55.61,81.52 43.42,81.52 39.76,85.17 39.76,86.24 39,87 39,87.77 21.64,87.77 21.64,77.23 11.11,77.23 11.11,59.88 19.64,59.88 19.64,51.8 21.32,51.8 22.69,50.43 22.69,48.14 21.62,47.07 19.64,47.07 19.64,39 11.11,39 11.11,21.64 21.64,21.64 21.64,11.23 39,11.23 39,12.18 39.76,12.94 39.76,13.85 43.26,17.36 56.07,17.36 59.42,14 59.42,12.63 60.03,12.02 60.03,11.23 77.38,11.23 77.38,21.64 87.77,21.64 87.77,35.03 87.31,35.49 87.31,39.15 79.08,39.15 79.08,47.38 77.4,47.38 76.33,48.45 76.33,50.27 77.71,51.65 79.08,51.65 79.08,60.03 87.31,60.03 87.31,63.53 88.07,64.3 88.07,77.54 77.69,77.54 77.69,88.07 59.72,88.07 59.72,87.31 58.96,86.55 58.96,85.33 55.46,81.82 43.57,81.82 40.06,85.33 40.06,86.39 39.3,87.16 39.3,88.07 21.34,88.07 21.34,77.54 10.8,77.54 10.8,59.57 19.34,59.57 19.34,51.49 21.17,51.49 22.39,50.27 22.39,48.29 21.47,47.38 19.34,47.38 19.34,39.3 10.8,39.3 10.8,21.34 21.34,21.34 21.34,10.93 39.3,10.93 39.3,12.02 40.06,12.78 40.06,13.7 43.42,17.05 55.91,17.05 59.11,13.85 59.11,12.48 59.72,11.87 59.72,10.93 77.69,10.93 77.69,21.34 88.07,21.34 88.07,35.19 87.61,35.64 87.61,39.45 79.38,39.45 79.38,47.68 77.55,47.68 76.62,48.62 76.62,50.1 77.86,51.34 79.38,51.34 79.38,59.72 87.61,59.72 87.61,63.38 88.38,64.14 88.38,77.84 77.99,77.84 77.99,88.38 59.42,88.38 59.42,87.46 58.66,86.7 58.66,85.48 55.3,82.13 43.72,82.13 40.37,85.48 40.37,86.55 39.61,87.31 39.61,88.38 21.03,88.38 21.03,77.84 10.5,77.84 10.5,59.27 19.03,59.27 19.03,51.19 21.01,51.19 22.08,50.12 22.08,48.45 21.32,47.68 19.03,47.68 19.03,39.61 10.5,39.61 10.5,21.03 21.03,21.03 21.03,10.62 39.61,10.62 39.61,11.87 40.37,12.63 40.37,13.55 43.57,16.75 55.76,16.75 58.81,13.7 58.81,12.33 59.42,11.72 59.42,10.62 77.99,10.62 77.99,21.03 88.38,21.03 88.38,35.34 87.92,35.8 87.92,39.76 79.69,39.76 79.69,47.99 77.71,47.99 76.94,48.75 76.94,49.97 78.01,51.04 79.69,51.04 79.69,59.42 87.92,59.42 87.92,63.23 88.68,63.99 88.68,78.14 78.3,78.14 78.3,88.68 59.11,88.68 59.11,87.61 58.35,86.85 58.35,85.63 55.15,82.43 43.87,82.43 40.67,85.63 40.67,86.7 39.91,87.46 39.91,88.68 20.73,88.68 20.73,78.14 10.19,78.14 10.19,58.96 18.73,58.96 18.73,39.91 10.19,39.91 10.19,20.73 20.73,20.73 20.73,10.32 39.91,10.32 39.91,11.57 40.67,12.33 40.67,13.39 43.72,16.44 55.61,16.44 58.5,13.55 58.5,12.18 59.11,11.57 59.11,10.32 78.3,10.32 78.3,20.73 88.68,20.73 88.68,35.49 88.22,35.95 88.22,40.06 79.99,40.06 79.99,59.11 88.22,59.11 88.22,63.08 88.98,63.84 88.98,78.45 78.6,78.45 78.6,88.98 58.81,88.98 58.81,87.77 58.05,87 58.05,85.78 55,82.74 44.03,82.74 40.98,85.78 40.98,86.85 40.22,87.61 40.22,88.98 20.42,88.98 20.42,78.45 9.89,78.45 9.89,58.66 18.42,58.66 18.42,40.22 9.89,40.22 9.89,20.42 20.42,20.42 20.42,10.02 40.22,10.02 40.22,11.41 40.98,12.18 40.98,13.24 43.87,16.14 55.46,16.14 58.2,13.39 58.2,12.02 58.81,11.41 58.81,10.02 78.6,10.02 78.6,20.42 88.98,20.42 88.98,35.64 88.53,36.1 88.53,40.37 80.3,40.37 80.3,58.81 88.53,58.81 88.53,62.92 89.29,63.69 89.29,78.75 78.91,78.75 78.91,89.29 58.5,89.29 58.5,87.92 57.74,87.16 57.74,85.94 54.85,83.04 44.18,83.04 41.28,85.94 41.28,87 40.52,87.77 40.52,89.29 20.12,89.29 20.12,78.75 9.58,78.75 9.58,58.35 18.12,58.35 18.12,40.52 9.58,40.52 9.58,20.12 20.12,20.12 20.12,9.71 40.52,9.71 40.52,11.26 41.28,12.02 41.28,13.09 44.03,15.83 55.3,15.83 57.9,13.24 57.9,11.87 58.5,11.26 58.5,9.71 78.91,9.71 78.91,20.12 89.29,20.12 89.29,35.8 88.83,36.25 88.83,40.67 80.6,40.67 80.6,58.43 88.83,58.43 88.83,62.77 89.59,63.53 89.59,79.06 79.21,79.06 79.21,89.59 58.2,89.59 58.2,88.07 57.44,87.31 57.44,86.09 54.69,83.35 44.33,83.35 41.59,86.09 41.59,87.16 40.83,87.92 40.83,89.59 19.81,89.59 19.81,79.06 9.28,79.06 9.28,58.05 17.81,58.05 17.81,40.83 9.43,40.83 9.28,40.67 9.28,19.81 19.81,19.81 19.81,9.41 40.83,9.41 40.83,11.11 41.59,11.87 41.59,12.94 44.18,15.53 55.15,15.53 57.59,13.09 57.59,11.72 58.2,11.11 58.2,9.41 79.21,9.41 79.21,19.81 89.59,19.81 89.59,35.95 89.14,36.41 89.14,40.98 80.91,40.98 80.91,58.05 89.14,58.05 89.14,62.62 89.9,63.38 89.9,79.36 79.52,79.36 79.52,89.9 57.9,89.9 57.9,88.22 57.13,87.46 57.13,86.24 54.54,83.65 44.48,83.65 41.89,86.24 41.89,87.31 41.13,88.07 41.13,89.9 19.51,89.9 19.51,79.36 8.97,79.36 8.97,57.9 12.78,54.09 12.78,44.64 8.97,40.83 8.97,19.51 19.51,19.51 19.51,9.1 41.1,9.1 41.13,9.13 41.13,10.96 41.89,11.72 41.89,12.78 44.33,15.22 55,15.22 57.28,12.94 57.28,11.57 57.9,10.96 57.9,9.13 57.92,9.1 79.52,9.1 79.52,19.51 89.9,19.51 89.9,36.1 89.44,36.56 89.44,42.05 86.39,45.09 86.39,53.78 89.44,56.83 89.44,62.47 90.2,63.23 90.2,79.67 79.82,79.67 79.82,90.2 57.74,90.2 57.59,90.05 57.59,88.38 56.83,87.61 56.83,86.39 54.39,83.95 44.64,83.95 42.2,86.39 42.2,87.46 41.44,88.22 41.44,90.05 41.28,90.2 19.2,90.2 19.2,79.67 8.67,79.67 8.67,57.74 12.48,53.93 12.48,44.79 8.67,40.98 8.67,19.2 19.2,19.2 19.2,8.8 41.26,8.8 41.44,8.97 41.44,10.8 42.2,11.57 42.2,12.63 44.48,14.92 54.85,14.92 56.98,12.78 56.98,11.41 57.59,10.8 57.59,8.97 57.77,8.8 79.82,8.8 79.82,19.2 90.2,19.2 90.2,36.25 89.75,36.71 89.75,42.2 86.7,45.25 86.7,53.63 89.75,56.68 89.75,62.31 90.51,63.08 90.51,79.97 80.13,79.97 80.13,90.51 57.59,90.51 57.28,90.2 57.28,88.53 56.52,87.77 56.52,86.55 54.24,84.26 44.79,84.26 42.5,86.55 42.5,87.61 41.74,88.38 41.74,90.2 41.44,90.51 18.9,90.51 18.9,79.97 8.37,79.97 8.37,57.59 12.18,53.78 12.18,44.94 8.37,41.13 8.37,18.9 18.9,18.9 18.9,8.49 41.41,8.49 41.74,8.82 41.74,10.65 42.5,11.41 42.5,12.48 44.64,14.61 54.69,14.61 56.68,12.63 56.68,11.26 57.28,10.65 57.28,8.82 57.62,8.49 80.13,8.49 80.13,18.9 90.51,18.9 90.51,36.41 90.05,36.86 90.05,42.35 87,45.4 87,53.48 90.05,56.52 90.05,62.16 90.81,62.92 90.81,80.28 80.43,80.28 80.43,90.81 57.44,90.81 56.98,90.36 56.98,88.68 56.22,87.92 56.22,86.7 54.09,84.56 44.94,84.56 42.81,86.7 42.81,87.77 42.05,88.53 42.05,90.36 41.59,90.81 18.59,90.81 18.59,80.28 8.06,80.28 8.06,57.44 11.87,53.63 11.87,45.09 8.06,41.28 8.06,18.59 18.59,18.59 18.59,8.19 41.56,8.19 42.05,8.67 42.05,10.5 42.81,11.26 42.81,12.33 44.79,14.31 54.54,14.31 56.37,12.48 56.37,11.11 56.98,10.5 56.98,8.67 57.46,8.19 80.43,8.19 80.43,18.59 90.81,18.59 90.81,36.56 90.36,37.02 90.36,42.5 87.31,45.55 87.31,53.32 90.36,56.37 90.36,62.01 91.12,62.77 91.12,80.58 80.74,80.58 80.74,91.12 57.28,91.12 56.68,90.51 56.68,88.83 55.91,88.07 55.91,86.85 53.93,84.87 45.09,84.87 43.11,86.85 43.11,87.92 42.35,88.68 42.35,90.51 41.74,91.12 18.29,91.12 18.29,80.58 7.75,80.58 7.75,57.28 11.57,53.48 11.57,45.25 7.75,41.44 7.75,18.29 18.29,18.29 18.29,7.88 41.72,7.88 42.35,8.52 42.35,10.35 43.11,11.11 43.11,12.18 44.94,14 54.39,14 56.07,12.33 56.07,10.96 56.68,10.35 56.68,8.52 57.31,7.88 80.74,7.88 80.74,18.29 91.12,18.29 91.12,36.71 90.66,37.17 90.66,42.66 87.61,45.7 87.61,53.17 90.66,56.22 90.66,61.86 91.42,62.62 91.42,80.89 81.04,80.89 81.04,91.42 57.13,91.42 56.37,90.66 56.37,88.98 55.61,88.22 55.61,87 53.78,85.17 45.25,85.17 43.42,87 43.42,88.07 42.66,88.83 42.66,90.66 41.89,91.42 17.98,91.42 17.98,80.89 7.45,80.89 7.45,57.13 11.26,53.32 11.26,45.4 7.45,41.59 7.45,17.98 17.98,17.98 17.98,7.58 41.87,7.58 42.66,8.37 42.66,10.19 43.42,10.96 43.42,12.02 45.09,13.7 54.24,13.7 55.76,12.18 55.76,10.8 56.37,10.19 56.37,8.37 57.16,7.58 81.04,7.58 81.04,17.98 91.42,17.98 91.42,36.86 90.97,37.32 90.97,42.81 87.92,45.85 87.92,53.02 90.97,56.07 90.97,61.7 91.73,62.47 91.73,81.19 81.35,81.19 81.35,91.73 56.98,91.73 56.07,90.81 56.07,89.14 55.3,88.38 55.3,87.16 53.63,85.48 45.4,85.48 43.72,87.16 43.72,88.22 42.96,88.98 42.96,90.81 42.05,91.73 17.68,91.73 17.68,81.19 7.15,81.19 7.15,56.98 10.96,53.17 10.96,45.55 7.15,41.74 7.15,17.68 17.68,17.68 17.68,7.27 42.02,7.27 42.96,8.21 42.96,10.04 43.72,10.8 43.72,11.87 45.25,13.39 54.09,13.39 55.46,12.02 55.46,10.65 56.07,10.04 56.07,8.21 57.01,7.27 81.35,7.27 81.35,17.68 91.73,17.68 91.73,37.02 91.27,37.47 91.27,42.96 88.22,46.01 88.22,52.87 91.27,55.91 91.27,61.55 92.03,62.31 92.03,81.5 81.65,81.5 81.65,92.03 56.83,92.03 55.76,90.97 55.76,89.29 55,88.53 55,87.31 53.48,85.78 45.55,85.78 44.03,87.31 44.03,88.38 43.26,89.14 43.26,90.97 42.2,92.03 17.38,92.03 17.38,81.5 6.84,81.5 6.84,56.83 10.65,53.02 10.65,45.7 6.84,41.89 6.84,17.38 17.38,17.38 17.38,6.97 42.17,6.97 43.26,8.06 43.26,9.89 44.03,10.65 44.03,11.72 45.4,13.09 53.93,13.09 55.15,11.87 55.15,10.5 55.76,9.89 55.76,8.06 56.85,6.97 81.65,6.97 81.65,17.38 92.03,17.38 92.03,37.17 91.58,37.63 91.58,43.11 88.53,46.16 88.53,52.71 91.58,55.76 91.58,61.4 92.34,62.16 92.34,81.8 81.95,81.8 81.95,92.34 56.68,92.34 55.46,91.12 55.46,89.44 54.69,88.68 54.69,87.46 53.32,86.09 45.7,86.09 44.33,87.46 44.33,88.53 43.57,89.29 43.57,91.12 42.35,92.34 17.07,92.34 17.07,81.8 6.54,81.8 6.54,56.68 10.35,52.87 10.35,45.85 6.54,42.05 6.54,17.07 17.07,17.07 17.07,6.66 42.33,6.66 43.57,7.91 43.57,9.74 44.33,10.5 44.33,11.57 45.55,12.78 53.78,12.78 54.85,11.72 54.85,10.35 55.46,9.74 55.46,7.91 56.7,6.66 81.95,6.66 81.95,17.07 92.34,17.07 92.34,37.32 91.88,37.78 91.88,43.26 88.83,46.31 88.83,52.56 91.88,55.61 91.88,61.25 92.64,62.01 92.64,82.11 82.26,82.11 82.26,92.64 56.37,92.64 56.37,92.49 55.15,91.27 55.15,89.59 54.39,88.83 54.39,87.61 53.17,86.39 45.85,86.39 44.64,87.61 44.64,88.68 43.87,89.44 43.87,91.27 42.5,92.64 16.77,92.64 16.77,82.11 6.23,82.11 6.23,56.52 10.04,52.71 10.04,46.01 6.23,42.2 6.23,16.77 16.77,16.77 16.77,6.36 42.66,6.36 42.66,6.54 43.87,7.75 43.87,9.58 44.64,10.35 44.64,11.41 45.7,12.48 53.63,12.48 54.54,11.57 54.54,10.19 55.15,9.58 55.15,7.75 56.37,6.54 56.37,6.36 82.26,6.36 82.26,16.77 92.64,16.77 92.64,37.47 92.19,37.93 92.19,43.42 89.14,46.47 89.14,52.41 92.19,55.46 92.19,61.09 92.95,61.86 92.95,82.41 82.56,82.41 82.56,92.95 56.07,92.95 56.07,92.64 54.85,91.42 54.85,89.75 54.09,88.98 54.09,87.77 53.02,86.7 46.01,86.7 44.94,87.77 44.94,88.83 44.18,89.59 44.18,91.42 42.96,92.64 42.96,92.95 16.46,92.95 16.46,82.41 5.93,82.41 5.93,56.07 6.23,56.07 9.74,52.56 9.74,46.16 6.54,42.96 5.93,42.96 5.93,16.46 16.46,16.46 16.46,6.05 42.96,6.05 42.96,6.38 44.18,7.6 44.18,9.43 44.94,10.19 44.94,11.26 45.85,12.18 53.48,12.18 54.24,11.41 54.24,10.04 54.85,9.43 54.85,7.6 56.07,6.38 56.07,6.05 82.56,6.05 82.56,16.46 92.95,16.46 92.95,37.63 92.49,38.08 92.49,43.57 89.44,46.62 89.44,52.26 92.49,55.3 92.49,60.94 93.25,61.7 93.25,82.72 82.87,82.72 82.87,93.25 55.76,93.25 55.76,92.79 54.54,91.58 54.54,89.9 53.78,89.14 53.78,87.92 52.87,87 46.16,87 45.25,87.92 45.25,88.98 44.48,89.75 44.48,91.58 43.26,92.79 43.26,93.25 16.16,93.25 16.16,82.72 5.62,82.72 5.62,55.76 6.08,55.76 9.43,52.41 9.43,46.31 6.38,43.26 5.62,43.26 5.62,16.16 16.16,16.16 16.16,5.75 43.26,5.75 43.26,6.23 44.48,7.45 44.48,9.28 45.25,10.04 45.25,11.11 46.01,11.87 53.32,11.87 53.93,11.26 53.93,9.89 54.54,9.28 54.54,7.45 55.76,6.23 55.76,5.75 82.87,5.75 82.87,16.16 93.25,16.16 93.25,37.78 92.79,38.23 92.79,43.72 89.75,46.77 89.75,52.1 92.79,55.15 92.79,60.79 93.56,61.55 93.56,83.02 83.17,83.02 83.17,93.56 55.46,93.56 55.46,92.95 54.24,91.73 54.24,90.05 53.48,89.29 53.48,88.07 52.71,87.31 46.31,87.31 45.55,88.07 45.55,89.14 44.79,89.9 44.79,91.73 43.57,92.95 43.57,93.56 15.85,93.56 15.85,83.02 5.32,83.02 5.32,55.46 5.93,55.46 9.13,52.26 9.13,46.47 6.23,43.57 5.32,43.57 5.32,15.85 15.85,15.85 15.85,5.44 43.57,5.44 43.57,6.08 44.79,7.3 44.79,9.13 45.55,9.89 45.55,10.96 46.16,11.57 53.02,11.57 53.63,10.96 53.63,9.74 54.24,9.13 54.24,7.3 55.46,6.08 55.46,5.44 83.17,5.44 83.17,15.85 93.56,15.85 93.56,37.93 93.1,38.39 93.1,43.87 90.05,46.92 90.05,51.95 93.1,55 93.1,60.64 93.86,61.4 93.86,83.33 83.48,83.33 83.48,93.86 55.15,93.86 55.15,93.1 53.93,91.88 53.93,90.2 53.17,89.44 53.17,88.22 52.56,87.61 46.47,87.61 45.85,88.22 45.85,89.29 45.09,90.05 45.09,91.88 43.87,93.1 43.87,93.86 15.55,93.86 15.55,83.33 5.01,83.33 5.01,55.15 5.77,55.15 8.82,52.1 8.82,46.62 6.08,43.87 5.01,43.87 5.01,15.55 15.55,15.55 15.55,5.14 43.87,5.14 43.87,5.93 45.09,7.15 45.09,8.97 45.85,9.74 45.85,10.8 46.31,11.26 52.87,11.26 53.32,10.8 53.32,9.58 53.93,8.97 53.93,7.15 55.15,5.93 55.15,5.14 83.48,5.14 83.48,15.55 93.86,15.55 93.86,38.08 93.4,38.54 93.4,44.03 90.36,47.07 90.36,51.8 93.4,54.85 93.4,60.49 94.17,61.25 94.17,83.63 83.78,83.63 83.78,94.17 54.85,94.17 54.85,93.25 53.63,92.03 53.63,90.36 52.87,89.59 52.87,88.38 52.41,87.92 46.62,87.92 46.16,88.38 46.16,89.44 45.4,90.2 45.4,92.03 44.18,93.25 44.18,94.17 15.24,94.17 15.24,83.63 4.71,83.63 4.71,54.85 5.62,54.85 8.52,51.95 8.52,46.77 5.93,44.18 4.71,44.18 4.71,15.24 15.24,15.24 15.24,4.83 44.18,4.83 44.18,5.77 45.4,6.99 45.4,8.82 46.16,9.58 46.16,10.65 46.47,10.96 52.71,10.96 53.02,10.65 53.02,9.43 53.63,8.82 53.63,6.99 54.85,5.77 54.85,4.83 83.78,4.83 83.78,15.24 94.17,15.24 94.17,38.23 93.71,38.69 93.71,43.42 94.5,44.2 94.5,44.48 93.4,44.48 90.66,47.23 90.66,51.65 93.71,54.69 93.71,60.33 94.47,61.09 94.47,83.94 84.09,83.94 84.09,94.47 54.54,94.47 54.54,93.56 51.8,90.81 47.33,90.81 44.48,93.66 44.48,94.47 14.94,94.47 14.94,83.94 4.4,83.94 4.4,54.54 5.47,54.54 8.21,51.8 8.21,46.92 5.77,44.48 4.4,44.48 4.4,14.94 14.94,14.94 14.94,4.53 44.48,4.53 44.48,5.58 47.12,8.21 51.8,8.21 54.54,5.47 54.54,4.53 84.09,4.53 84.09,14.94 94.47,14.94 94.47,38.39 94.01,38.84 94.01,43.26 94.8,44.05 94.8,44.79 93.56,44.79 90.97,47.38 90.97,51.49 93.71,54.24 94.8,54.24 94.8,54.97 94.01,55.76 94.01,60.18 94.78,60.94 94.78,84.24 84.39,84.24 84.39,94.78 54.24,94.78 54.24,93.71 51.65,91.12 47.43,91.12 44.79,93.76 44.79,94.78 14.63,94.78 14.63,84.24 4.1,84.24 4.1,54.24 5.32,54.24 7.91,51.65 7.91,47.07 5.62,44.79 4.1,44.79 4.1,14.63 14.63,14.63 14.63,4.22 44.79,4.22 44.79,5.32 47.38,7.91 51.65,7.91 54.24,5.32 54.24,4.22 84.39,4.22 84.39,14.63 94.78,14.63 94.78,38.54 94.32,39 94.32,43.11 95.11,43.9 95.11,45.09 93.71,45.09 91.27,47.53 91.27,51.34 93.86,53.93 95.11,53.93 95.11,55.13 94.32,55.91 94.32,60.03 95.08,60.79 95.08,84.55 84.7,84.55 84.7,95.08 53.93,95.08 53.93,93.86 51.49,91.42 47.58,91.42 45.09,93.91 45.09,95.08 14.33,95.08 14.33,84.55 3.79,84.55 3.79,53.93 5.16,53.93 7.6,51.49 7.6,47.23 5.47,45.09 3.79,45.09 3.79,14.33 14.33,14.33 14.33,3.92 45.09,3.92 45.09,5.16 47.53,7.6 51.49,7.6 53.93,5.16 53.93,3.92 84.7,3.92 84.7,14.33 95.08,14.33 95.08,38.69 94.62,39.15 94.62,42.96 95.41,43.75 95.41,45.4 93.86,45.4 91.58,47.68 91.58,51.19 94.01,53.63 95.41,53.63 95.41,55.28 94.62,56.07 94.62,59.88 95.39,60.64 95.39,84.85 85,84.85 85,95.39 53.63,95.39 53.63,94.01 51.34,91.73 47.74,91.73 45.4,94.07 45.4,95.39 14.02,95.39 14.02,84.85 3.49,84.85 3.49,53.63 5.01,53.63 7.3,51.34 7.3,47.38 5.32,45.4 3.49,45.4 3.49,14.02 14.02,14.02 14.02,3.62 45.4,3.62 45.4,5.01 47.68,7.3 51.34,7.3 53.63,5.01 53.63,3.62 85,3.62 85,14.02 95.39,14.02 95.39,38.84 94.93,39.3 94.93,42.81 95.72,43.59 95.72,45.7 94.01,45.7 91.88,47.84 91.88,51.04 94.17,53.32 95.72,53.32 95.72,55.43 94.93,56.22 94.93,59.72 95.69,60.49 95.69,85.16 85.31,85.16 85.31,95.69 53.32,95.69 53.32,94.17 51.19,92.03 47.89,92.03 45.7,94.22 45.7,95.69 13.72,95.69 13.72,85.16 3.18,85.16 3.18,53.32 4.86,53.32 6.99,51.19 6.99,47.53 5.16,45.7 3.18,45.7 3.18,13.72 13.72,13.72 13.72,3.31 45.7,3.31 45.7,4.86 47.84,6.99 51.19,6.99 53.32,4.86 53.32,3.31 85.31,3.31 85.31,13.72 95.69,13.72 95.69,39 95.23,39.45 95.23,42.66 96.02,43.44 96.02,46.01 94.17,46.01 92.19,47.99 92.19,50.88 94.32,53.02 96.02,53.02 96.02,55.58 95.23,56.37 95.23,59.57 96,60.33 96,85.46 85.61,85.46 85.61,96 53.02,96 53.02,94.32 51.04,92.34 48.04,92.34 46.01,94.37 46.01,96 13.41,96 13.41,85.46 2.88,85.46 2.88,53.02 4.71,53.02 6.69,51.04 6.69,47.68 5.01,46.01 2.88,46.01 2.88,13.41 13.41,13.41 13.41,3 46.01,3 46.01,4.71 47.99,6.69 51.04,6.69 53.02,4.71 53.02,3 85.61,3 85.61,13.41 96,13.41 96,39.15 95.54,39.61 95.54,42.5 96.33,43.29 96.33,46.31 94.32,46.31 92.49,48.14 92.49,50.73 94.47,52.71 96.33,52.71 96.33,55.74 95.54,56.52 95.54,59.42 96.3,60.18 96.3,85.77 85.92,85.77 85.92,96.3 52.71,96.3 52.71,94.47 50.88,92.64 48.19,92.64 46.31,94.52 46.31,96.3 13.11,96.3 13.11,85.77 2.57,85.77 2.57,52.71 4.55,52.71 6.38,50.88 6.38,47.84 4.86,46.31 2.57,46.31 2.57,13.11 13.11,13.11 13.11,2.7 46.31,2.7 46.31,4.55 48.14,6.38 50.88,6.38 52.71,4.55 52.71,2.7 85.92,2.7 85.92,13.11 96.3,13.11 96.3,39.3 95.84,39.76 95.84,42.35 96.63,43.14 96.63,46.62 94.47,46.62 92.79,48.29 92.79,50.58 94.62,52.41 96.6,52.41 96.63,52.43 96.63,55.89 95.84,56.68 95.84,59.27 96.6,60.03 96.6,86.07 86.22,86.07 86.22,96.6 52.56,96.6 52.41,96.45 52.41,94.62 50.73,92.95 48.35,92.95 46.62,94.68 46.62,96.45 46.47,96.6 12.8,96.6 12.8,86.07 2.27,86.07 2.27,52.41 4.4,52.41 6.08,50.73 6.08,47.99 4.71,46.62 2.27,46.62 2.27,12.8 12.8,12.8 12.8,2.4 46.59,2.4 46.62,2.42 46.62,4.4 48.29,6.08 50.73,6.08 52.41,4.4 52.41,2.42 52.43,2.4 86.22,2.4 86.22,12.8 96.6,12.8 96.6,39.45 96.15,39.91 96.15,42.2 96.94,42.98 96.94,46.9 96.91,46.92 94.62,46.92 93.1,48.45 93.1,50.43 94.78,52.1 96.76,52.1 96.94,52.28 96.94,56.04 96.15,56.83 96.15,59.11 96.91,59.88 96.91,86.38 86.53,86.38 86.53,96.91 52.41,96.91 52.1,96.6 52.1,94.78 50.58,93.25 48.5,93.25 46.92,94.83 46.92,96.76 46.77,96.91 12.5,96.91 12.5,86.38 1.96,86.38 1.96,52.26 2.12,52.1 4.25,52.1 5.77,50.58 5.77,48.14 4.55,46.92 2.12,46.92 1.96,46.77 1.96,12.5 12.5,12.5 12.5,2.09 46.74,2.09 46.92,2.27 46.92,4.25 48.45,5.77 50.58,5.77 52.1,4.25 52.1,2.27 52.28,2.09 86.53,2.09 86.53,12.5 96.91,12.5 96.91,39.61 96.45,40.06 96.45,42.05 97.24,42.83 97.24,47.05 97.06,47.23 94.78,47.23 93.4,48.6 93.4,50.27 94.93,51.8 96.91,51.8 97.24,52.13 97.24,56.34 96.45,57.13 96.45,58.96 97.21,59.72 97.21,86.68 86.83,86.68 86.83,97.21 52.26,97.21 51.8,96.76 51.8,94.93 50.43,93.56 48.6,93.56 47.23,94.93 47.23,96.91 46.92,97.21 12.19,97.21 12.19,86.68 1.66,86.68 1.66,51.95 1.81,51.8 4.1,51.8 5.47,50.43 5.47,48.29 4.4,47.23 1.81,47.23 1.66,47.07 1.66,12.19 12.19,12.19 12.19,1.79 46.9,1.79 47.23,2.12 47.23,4.1 48.6,5.47 50.43,5.47 51.8,4.1 51.8,2.12 52.13,1.79 86.83,1.79 86.83,12.19 97.21,12.19 97.21,39.76 96.76,40.22 96.76,41.89 97.54,42.68 97.54,47.35 97.36,47.54 95.01,47.54 93.71,48.85 93.71,50.15 95.05,51.49 97.21,51.49 97.54,51.82 97.54,56.5 96.76,57.28 96.76,58.81 97.52,59.57 97.52,86.98 87.14,86.98 87.14,97.52 51.95,97.52 51.49,97.06 51.49,95.05 50.31,93.87 48.69,93.87 47.53,95.03 47.53,97.06 47.07,97.52 11.89,97.52 11.89,86.98 1.35,86.98 1.35,51.8 1.66,51.49 3.97,51.49 5.13,50.34 5.13,48.41 4.25,47.53 1.66,47.53 1.35,47.23 1.35,11.89 11.89,11.89 11.89,1.48 47.05,1.48 47.54,1.98 47.54,4.01 48.69,5.16 50.31,5.16 51.46,4.01 51.46,2 51.98,1.48 87.14,1.48 87.14,11.89 97.52,11.89 97.52,39.91 97.06,40.37 97.06,41.74 97.85,42.53 97.85,56.65 97.06,57.44 97.06,58.66 97.82,59.42 97.82,87.29 87.44,87.29 87.44,97.82 11.58,97.82 11.58,87.29 1.05,87.29 1.05,11.58 11.58,11.58 11.58,1.18 87.44,1.18 87.44,11.58 97.82,11.58 97.82,40.06 97.37,40.52 97.37,41.59 98.15,42.38 98.15,56.8 97.37,57.59 97.37,58.5 98.13,59.27 98.13,87.59 87.75,87.59 87.75,98.13 11.28,98.13 11.28,87.59 0.75,87.59 0.75,11.28 11.28,11.28 11.28,0.87 87.75,0.87 87.75,11.28 98.13,11.28 98.13,40.22 97.67,40.67 97.67,41.44 98.54,42.31 98.54,56.87 97.67,57.74 97.67,58.35 98.54,59.22 98.54,87.92 88.04,87.92 88.04,98.42 10.96,98.42 10.96,87.92 0.46,87.92 0.46,10.98 10.96,10.98 10.96,0.48 88.04,0.48 88.04,10.98 98.54,10.98 98.54,40.78 v98.34,40.98